# EAGLE design rev2.2.3 (EAGLE 9.3.1)
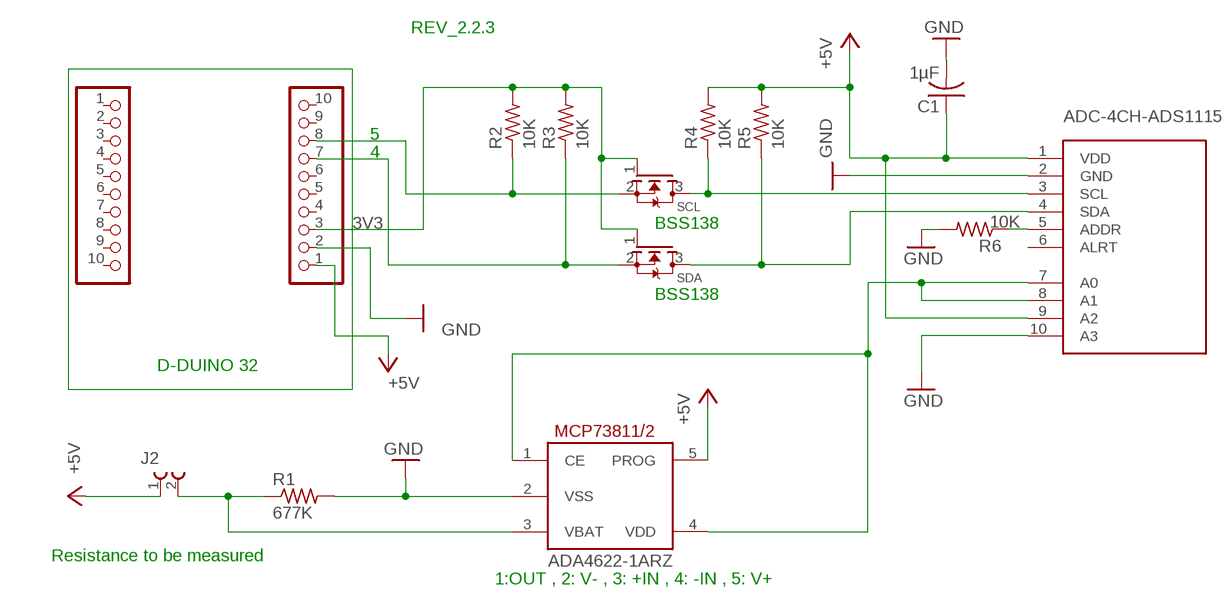
[diagram p0: schematic, sheet 1]

## Parts
ADA4622-1ARZ  MCP73811/2  [SOT23-5L]
C1  1µF  C-USC1608  [C1608]
J2  691103110002  [691103110002]
JP1  PINHD-1X10  [1X10]
JP3  PINHD-1X10  [1X10]
R1  677K  R-US_M0805  [M0805]
R2  10K  R-US_M0805  [M0805]
R3  10K  R-US_M0805  [M0805]
R4  10K  R-US_M0805  [M0805]
R5  10K  R-US_M0805  [M0805]
R6  10K  R-US_M0805  [M0805]
SCL  MOSFET-NWAVE  [SOT23-W]
SDA  MOSFET-NWAVE  [SOT23-W]
U$1  ADC-4CH-ADS1115  [ADC-4CH-ADS1115]

## Nets
3V3: JP1.3 R2.2 R3.2 SCL.1(G) SDA.1(G)
4: JP1.7 R3.1 SDA.2(S)
+5V: ADA4622-1ARZ.5(PROG) J2.1 JP1.1
A1: ADA4622-1ARZ.1(CE) ADA4622-1ARZ.4(VDD) U$1.7(A0) U$1.8(A1)
GND: ADA4622-1ARZ.2(VSS) C1.2 JP1.2 R1.2 R6.2 U$1.2(GND) U$1.10(A3)
N$1: ADA4622-1ARZ.3(VBAT) J2.2 R1.1
N$2: JP1.8 R2.1 SCL.2(S)
N$3: R6.1 U$1.5(ADDR)
N$5: JP1.9
SCL: R4.1 SCL.3(D) U$1.3(SCL)
SDA: R5.1 SDA.3(D) U$1.4(SDA)
VDD: C1.1 R4.2 R5.2 U$1.1(VDD) U$1.9(A2) ; supply symbol labelled +5V
Unconnected: JP1.4 JP1.5 JP1.6 JP1.10 JP3.1 JP3.2 JP3.3 JP3.4 JP3.5 JP3.6 JP3.7 JP3.8 JP3.9 JP3.10 U$1.6(ALRT)

## Notes on the sheet
- REV_2.2.3
- 5
- 4
- BSS138
- BSS138
- D-DUINO 32
- Resistance to be measured
- 1:OUT , 2: V- , 3: +IN , 4: -IN , 5: V+

## Library data of the parts
ADA4622-1ARZ = adafruit:MCP73811/2: MCP73811 and MCP73812 Simple, Miniature Single-Cell, Fully Integrated Li-Ion / Li-Polymer Charge Management Controllers SOT-23-5 package, no indicator LED but with adjustable current, small and very inexpensive
C1 = adafruit:C-US: CAPACITOR, American symbol
J2 = Wurth_Elektronik_Electromechanic_Terminal_Blocks_Connectors_rev18a:691103110002: WR-TBL Serie 1031 - 3.5mm Horizontal Entry Modular with Pressure Clamp - 1.5mm2 Wires, 2 Pins=>Code : Con_TBL_Screw_PressureClamp_6911103110002 <http://katalog.we-online.de/media/images/eican/Con_TBL_Screw_PressureClamp_69111031100xx_pf2.jpg> Details see: http://katalog.we-online.de/en/em/691_103_110_0xx Created 2014-06-16, Karrer Zheng 2014 (C) Würth Elektronik
JP1 JP3 = pinhead:PINHD-1X10: PIN HEADER
R1-R6 = adafruit:R-US_: RESISTOR, American symbol
SCL SDA = adafruit:MOSFET-N: N-Channel Mosfet 2N7002E - 60V 260mA SOT23 [Digikey: 2N7002ET1GOSTR-ND] - REEL BSH103 - 30V 850mA SOT23 [Digikey: 568-5013-1-ND]
U$1 = diy-modules:ADC-4CH-ADS1115: 4 Channel 16-Bit Analog-to-Digital Converter based on ADS1115 chip Arduino ADS1115 Getting Started Tutorial is available here: http://henrysbench.capnfatz.com/henrys-bench/arduino-voltage-measurements/arduino-ads1115-module-getting-started-tutorial/ ADS1115 datasheet is available here: http://www.ti.com/lit/ds/symlink/ads1115.pdf Click here to find device on ebay.com <http://www.ebay.com/sch/ads1115+module>

## Net classes
0 default: width 0.559 mm, drill 0.508 mm, clearance 0.381 mm

## Board
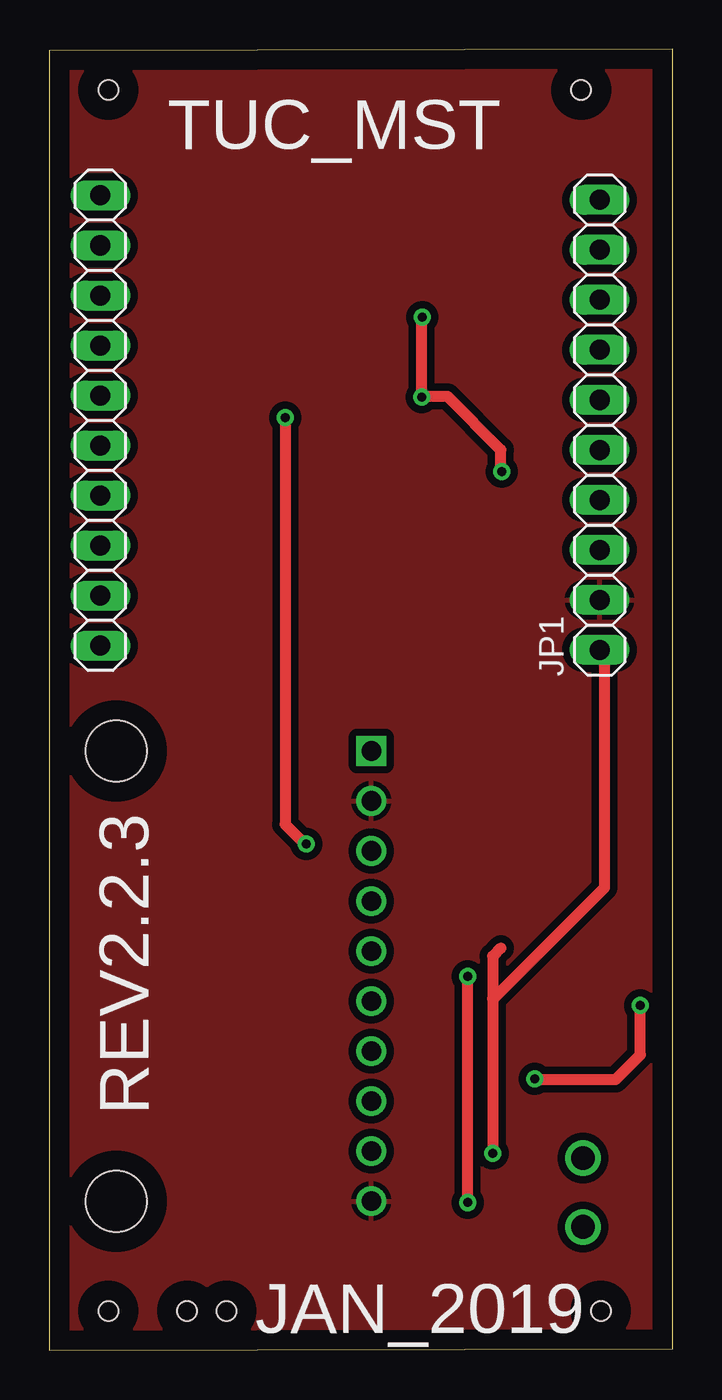
[diagram p1: board, top side]
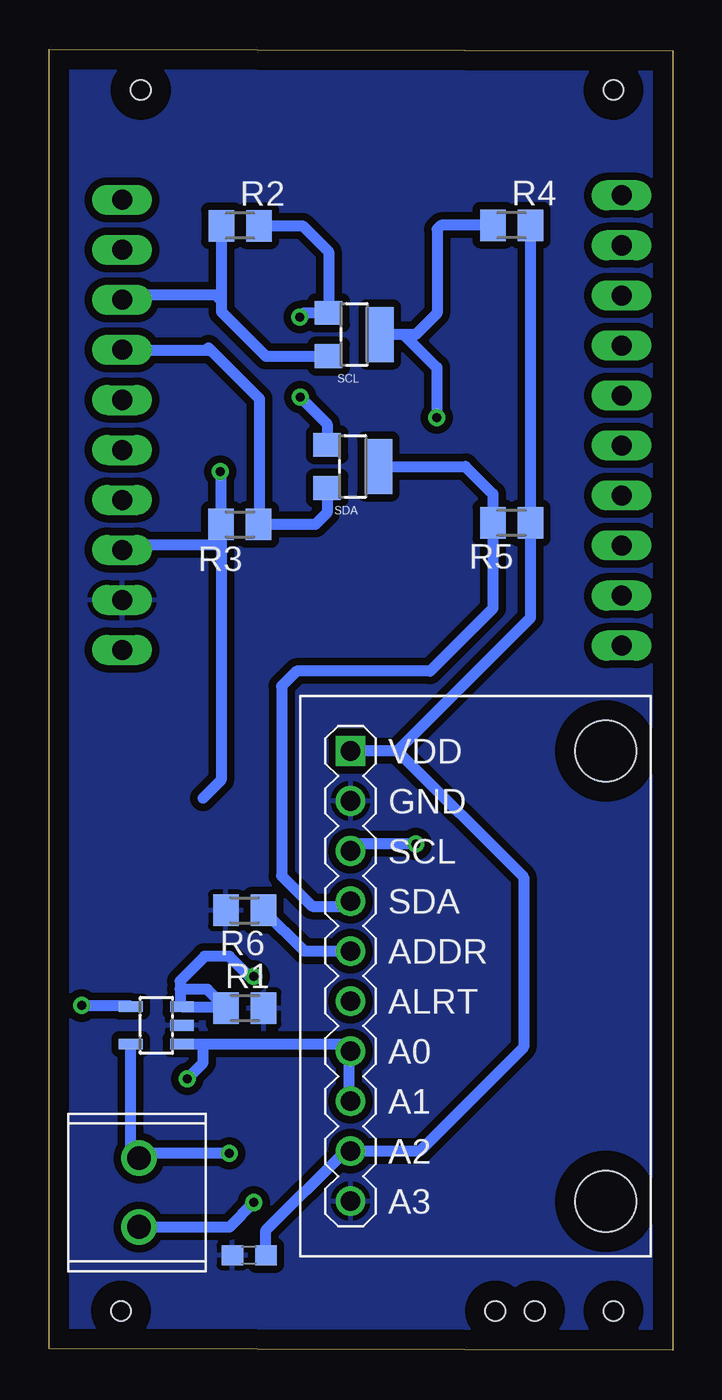
[diagram p2: board, bottom side, seen from below]

Size 31.64 x 66.06 mm. Coordinates in mm from the lower left corner, seen from the top.
Outline: 0,0 31.64,0.06 31.64,66.06 0,66 0,0
Copper layers (1*16): Top 0.035mm / dielectric 1.5mm / Bottom 0.035mm
Design rules "default": minimum track width 6mil, minimum drill 0.35mm, track to track 6mil, track to pad 6mil, pad to pad 6mil, via to via 6mil, smd to smd 6mil, copper to edge 40mil, drill to drill 6mil, minimum pad ring 10mil, minimum via ring 8mil, stop-mask expansion 4mil, vias tented up to drill 0mil, thermal gap 10mil
Holes 1 mm at 3,64 27,64 3,2 7,2 9,2 28,2

### Footprints (pad centres in the part's own frame; a part is rotated, then mirrored left to right if it is on the bottom)
SOT23-5L = smd 0.55 x 1.2: 1 -0.95,-1.3; 2 0,-1.3; 3 0.95,-1.3; 4 0.95,1.3; 5 -0.95,1.3
C1608 = smd 1.1 x 1: 1 -0.85,0; 2 0.85,0
691103110002 = drill 1.2: 1 -1.75,0; 2 1.75,0
1X10 = drill 1.016 long: 1 -11.43,0; 2 -8.89,0; 3 -6.35,0; 4 -3.81,0; 5 -1.27,0; 6 1.27,0; 7 3.81,0; 8 6.35,0; 9 8.89,0; 10 11.43,0
M0805 = smd 1.3 x 1.6: 1 -0.95,0; 2 0.95,0
SOT23-W = smd 1.2 x 1.4: 1 -1.1,-1.3; 2 1.1,-1.3 | smd 2.8 x 1.4: 3 0,1.3
ADC-4CH-ADS1115 = drill 1 square: 1 -6.35,11.43 | drill 1: 2 -6.35,8.89; 3 -6.35,6.35; 4 -6.35,3.81; 5 -6.35,1.27; 6 -6.35,-1.27; 7 -6.35,-3.81; 8 -6.35,-6.35; 9 -6.35,-8.89; 10 -6.35,-11.43 | hole 3.1: 6.604,11.43; 6.604,-11.43

### Placement (x,y rotation side)
ADA4622-1ARZ  26.21,16.5 90 bottom
C1  21.5,4.82 180 bottom
J2  27.09,8.02 270 bottom
JP1  27.94,46.99 90 top
JP3  2.59,47.21 270 top
R1  21.71,17.37 0 bottom
R2  21.95,57.1 0 bottom
R3  21.97,41.94 180 bottom
R4  8.17,57.12 0 bottom
R5  8.17,42.01 0 bottom
R6  21.72,22.35 180 bottom
SCL  16.16,51.58 270 bottom
SDA  16.24,44.88 270 bottom
U$1  10,19 0 bottom

### Tracks (layer width: path | path; a pad name or v marks a point on that pad's centre or on a via)
3V3  (via drill 0.46)
  Top 0.559: v22.96,44.62 22.93,44.65 22.93,45.72 20.22,48.43 18.84,48.43 18.87,48.4 v18.9,48.4 18.9,52.43 v18.93,52.46
  Bottom 0.559: R2.2 18.78,57.1 17.46,55.79 SCL.1 18.71,52.68 v18.93,52.46 | v22.96,44.62 22.93,44.65 22.93,44.68 22.92,44.67 R3.2 22.92,40.88 | v18.9,48.4 17.54,47.04 SDA.1 | 22.92,40.88 22.92,28.95 23.83,28.04 | 22.92,40.88 27.72,40.88 JP1.3
4
  Bottom 0.559: SDA.2 17.54,42.53 18.13,41.94 20.98,41.94 | 20.98,41.94 R3.1 | 20.98,41.94 20.98,48.31 23.45,50.79 | 23.57,50.9 23.45,50.79 | JP1.7 27.72,50.75 23.5,50.75 23.45,50.79
+5V  (via drill 0.46)
  Top 0.559: 22.92,20.42 22.5,20 22.5,17.86 | 22.5,17.86 v22.5,10 | JP1.1 28.19,35.24 28.19,23.5 22.55,17.86 22.5,17.86
  Bottom 0.559: ADA4622-1ARZ.5 27.51,10.18 J2.1 26.78,9.87 26.78,10 | v22.5,10 26.78,10 | 26.78,10 26.86,10
A1  (via drill 0.46)
  Top 0.559: 24.67,13.77 v24.64,13.79 24.68,13.75 28.75,13.75 30,15 v30,17.5
  Bottom 0.559: ADA4622-1ARZ.1 23.83,15.55 | 23.83,15.55 16.71,15.55 U$1.7 16.45,15.04 16.45,12.69 U$1.8 | v24.64,13.79 23.83,14.6 23.83,15.55 | v30,17.5 27.56,17.5 ADA4622-1ARZ.4
GND
  pour Top: -1,68 34.54,68 34.54,-1 0,-1 -1,0
  pour Bottom: -1,69 35.54,69 35.54,-2 -1,-2 -3,0 -3,67
N$1  (via drill 0.46)
  Top 0.559: v21.25,7.5 v21.25,18.98
  Bottom 0.559: ADA4622-1ARZ.3 22.74,17.45 R1.1 23.62,18.33 25,18.33 | J2.2 22.48,6.27 v21.25,7.5 | v21.25,18.98 21.48,18.98 22.5,20 23.75,20 25,18.75 25,18.33 | 25,18.33 25,17.5
N$2
  Bottom 0.559: 22.82,57.45 R2.1 | 23,57 R2.1 | R2.1 22.9,53.29 | 22.9,53.29 22.9,52.74 20.64,50.48 SCL.2 | 22.9,53.29 23.05,53.44 23.02,53.57 27.72,53.57 JP1.8
N$3
  Bottom 0.559: R6.1 18.7,20.27 U$1.5
SCL  (via drill 0.46)
  Top 0.559: v11.97,47.37 11.97,26.7 12.96,25.72 v13.04,25.72
  Bottom 0.559: 14.95,51.66 SCL.3 13.64,51.58 | R4.1 11.75,57.12 11.96,56.92 11.96,52.66 13.04,51.58 13.64,51.58 | 13.64,51.58 11.97,49.91 v11.97,47.37 | v13.04,25.72 15.98,25.72 U$1.3
SDA
  Bottom 0.559: 9.01,41.9 R5.1 | SDA.3 10.52,44.88 9.12,43.48 R5.1 | R5.1 9.12,37.68 12.31,34.48 19.09,34.48 19.84,33.72 19.84,24.09 18.3,22.55 16.61,22.55 U$1.4
VDD
  Bottom 0.559: 7.07,57.03 R4.2 R5.2 | 7.01,41.8 R5.2 | R5.2 7.22,37.18 13.97,30.43 | 13.97,30.43 U$1.1 | C1.1 20.65,6.09 16.63,10.11 U$1.9 12.84,10.11 7.56,15.38 7.56,24.02 13.97,30.43

### Text on the board
tPlace: TUC_MST | REV2.2.3 | JAN_2019